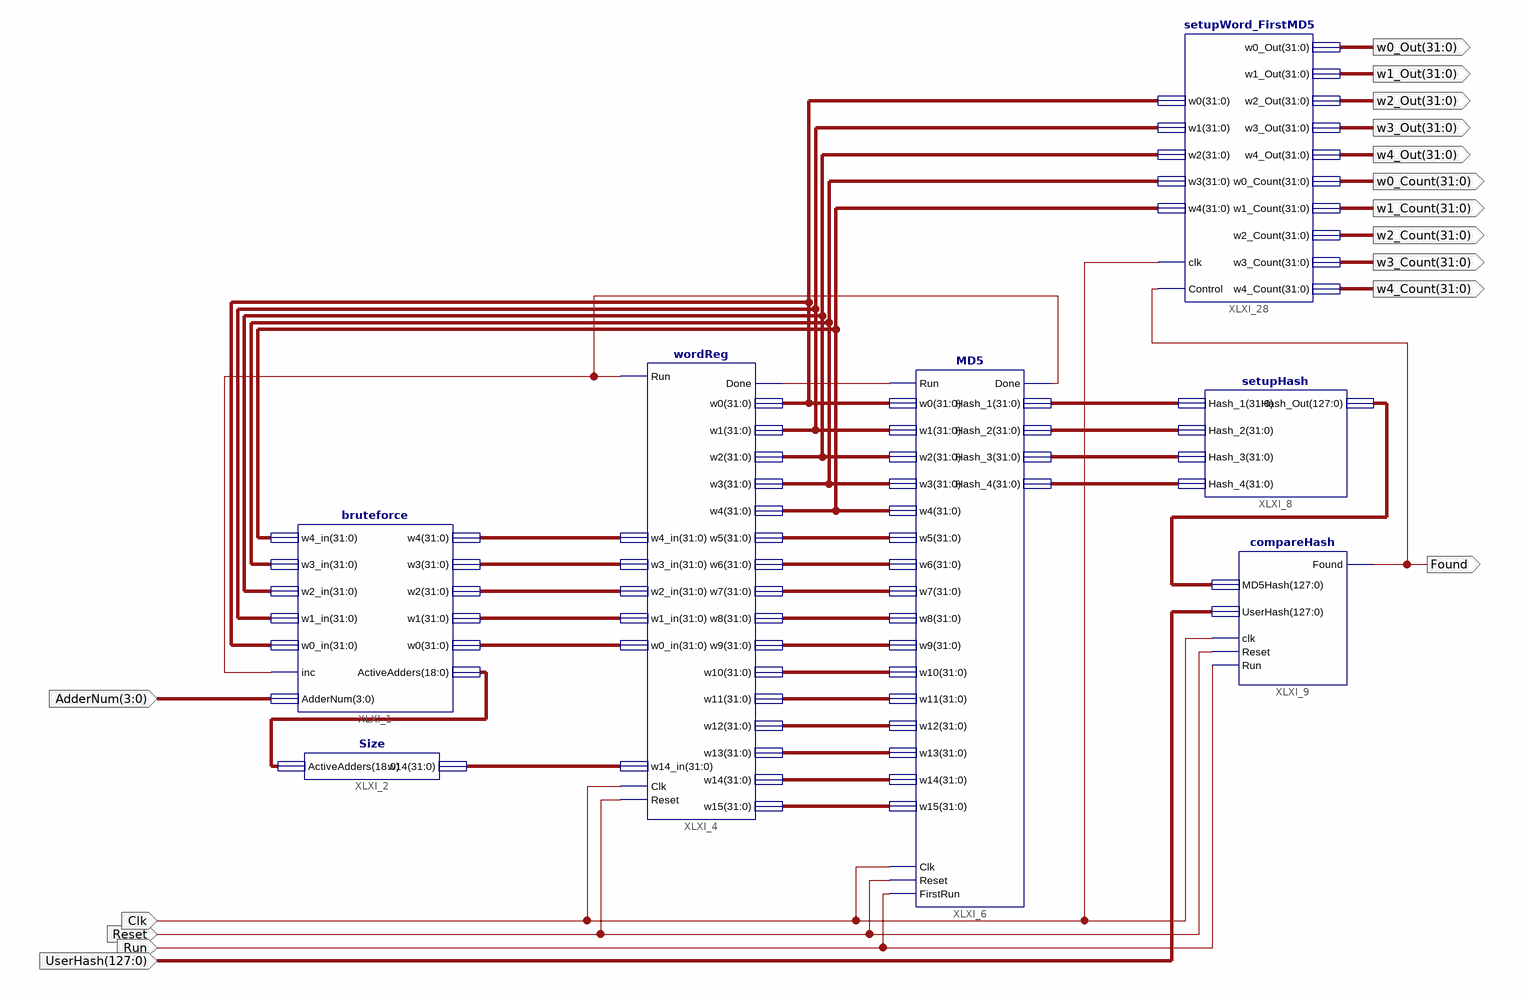
[diagram p0: schematic sheet 1]
// Xilinx ISE schematic First_MD5_Crack.sch (spartan3a) as structural Verilog: 7 symbols, 16 ports
module First_MD5_Crack (
  input  [3:0] AdderNum,
  input  Reset,
  input  Clk,
  input  Run,
  input  [127:0] UserHash,
  output Found,
  output [31:0] w0_Out,
  output [31:0] w1_Out,
  output [31:0] w2_Out,
  output [31:0] w3_Out,
  output [31:0] w4_Out,
  output [31:0] w0_Count,
  output [31:0] w1_Count,
  output [31:0] w2_Count,
  output [31:0] w3_Count,
  output [31:0] w4_Count
);

  wire XLXN_29, XLXN_30;
  wire [18:0] XLXN_1;
  wire [31:0] w0_regout, w1_regout, w2_regout, w3_regout, w4_regout, XLXN_8, XLXN_31, XLXN_32, XLXN_33,
       XLXN_34, XLXN_143, XLXN_144, XLXN_145, XLXN_146, XLXN_147, XLXN_148, XLXN_149, XLXN_150, XLXN_151,
       XLXN_152, XLXN_153, XLXN_154, XLXN_155, XLXN_156, XLXN_157, XLXN_158;
  wire [127:0] HashOut;

  bruteforce XLXI_1 (
    .w4_in(w4_regout), .w3_in(w3_regout), .w2_in(w2_regout), .w1_in(w1_regout), .w0_in(w0_regout),
    .inc(XLXN_30), .AdderNum(AdderNum), .w4(XLXN_154), .w3(XLXN_155), .w2(XLXN_156), .w1(XLXN_157),
    .w0(XLXN_158), .ActiveAdders(XLXN_1));
  wordReg XLXI_4 (
    .w0(w0_regout), .w1(w1_regout), .w2(w2_regout), .w3(w3_regout), .w4(w4_regout), .w5(XLXN_143),
    .w6(XLXN_144), .w7(XLXN_145), .w8(XLXN_146), .w9(XLXN_147), .w10(XLXN_148), .w11(XLXN_149),
    .w12(XLXN_150), .w13(XLXN_151), .w14(XLXN_152), .w15(XLXN_153), .w4_in(XLXN_154), .w14_in(XLXN_8),
    .Reset(Reset), .Clk(Clk), .Run(XLXN_30), .Done(XLXN_29), .w3_in(XLXN_155), .w2_in(XLXN_156),
    .w1_in(XLXN_157), .w0_in(XLXN_158));
  Size XLXI_2 (.ActiveAdders(XLXN_1), .w14(XLXN_8));
  MD5 XLXI_6 (
    .Done(XLXN_30), .w0(w0_regout), .w1(w1_regout), .w2(w2_regout), .w3(w3_regout), .w4(w4_regout),
    .w5(XLXN_143), .w6(XLXN_144), .w7(XLXN_145), .w8(XLXN_146), .w9(XLXN_147), .w10(XLXN_148),
    .w11(XLXN_149), .w12(XLXN_150), .w13(XLXN_151), .w14(XLXN_152), .w15(XLXN_153), .Run(XLXN_29), .Clk(Clk),
    .Reset(Reset), .FirstRun(Run), .Hash_1(XLXN_31), .Hash_2(XLXN_32), .Hash_3(XLXN_33), .Hash_4(XLXN_34));
  setupHash XLXI_8 (.Hash_1(XLXN_31), .Hash_2(XLXN_32), .Hash_3(XLXN_33), .Hash_4(XLXN_34), .Hash_Out(HashOut));
  compareHash XLXI_9 (.Found(Found), .MD5Hash(HashOut), .UserHash(UserHash), .clk(Clk), .Reset(Reset), .Run(Run));
  setupWord_FirstMD5 XLXI_28 (
    .w0_Out(w0_Out), .w1_Out(w1_Out), .w2_Out(w2_Out), .w3_Out(w3_Out), .w4_Out(w4_Out), .w0_Count(w0_Count),
    .w1_Count(w1_Count), .w2_Count(w2_Count), .w3_Count(w3_Count), .w4_Count(w4_Count), .clk(Clk),
    .Control(Found), .w0(w0_regout), .w1(w1_regout), .w2(w2_regout), .w3(w3_regout), .w4(w4_regout));
endmodule
